# EAGLE design TransistorsArduino (EAGLE 6.1)
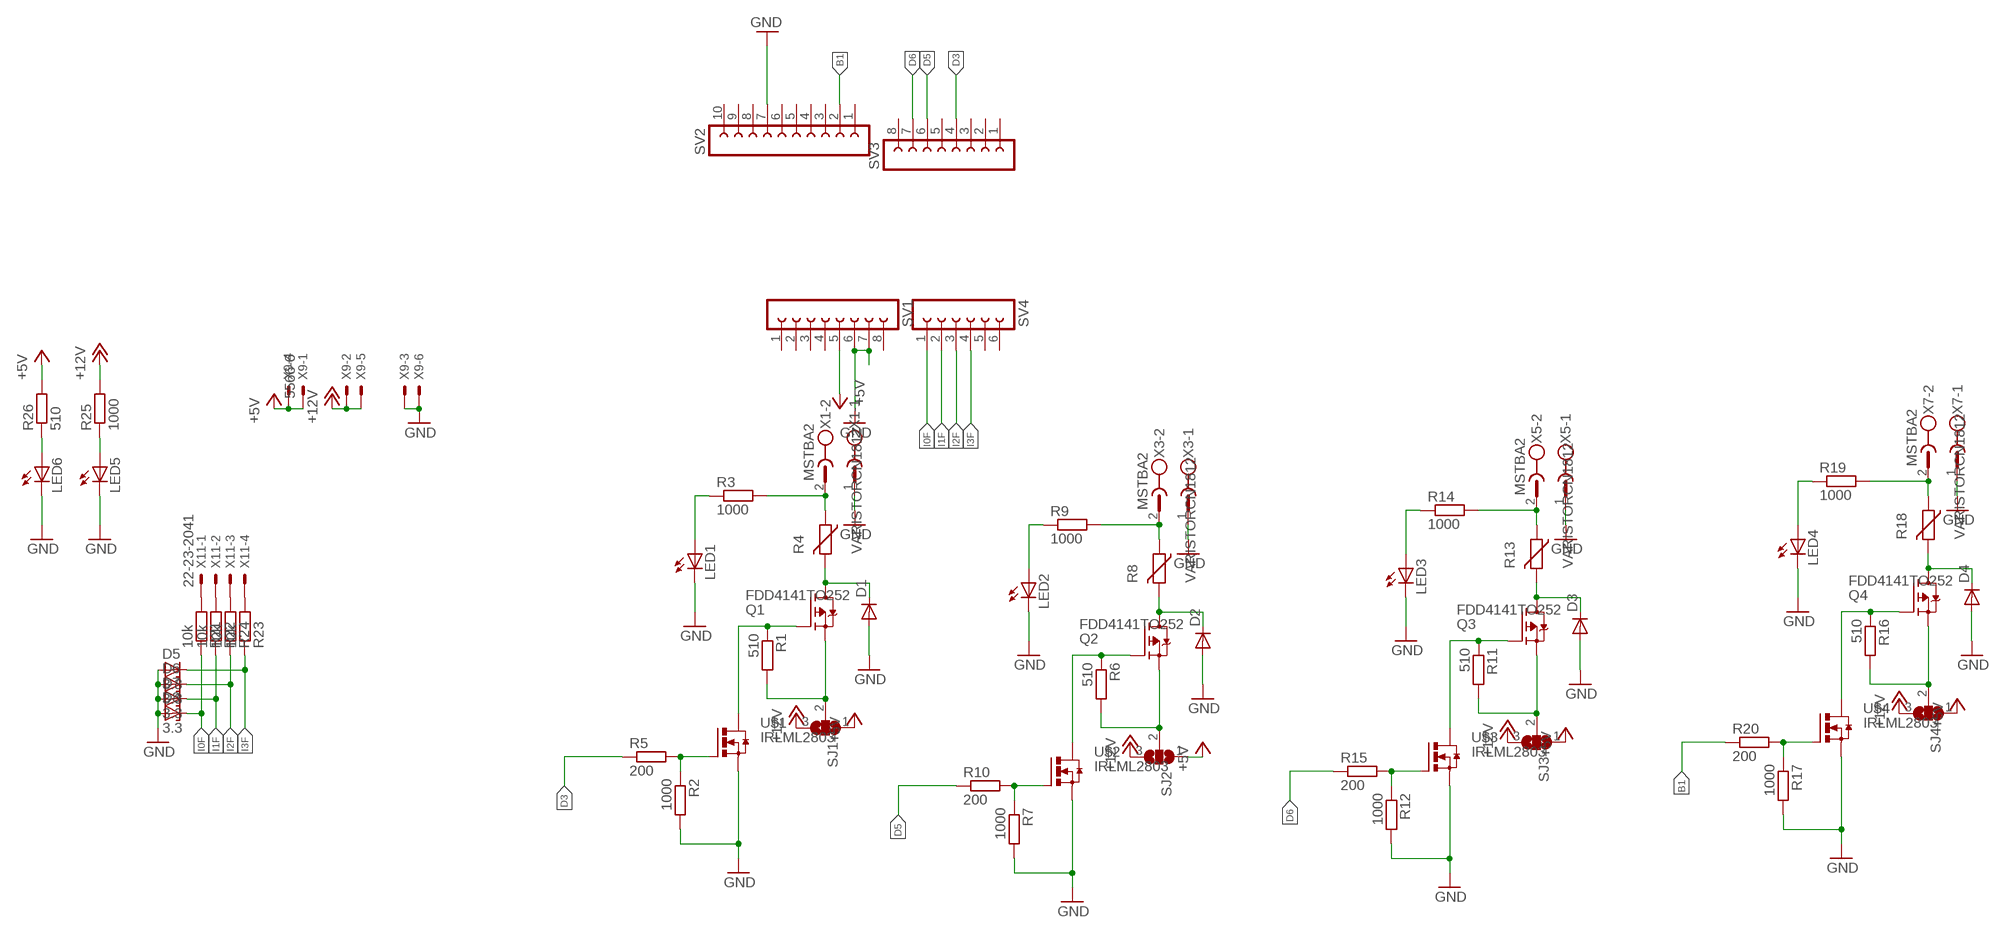
[diagram p0: schematic, sheet 1]

## Parts
D1  DIODE-SMB  [SMB]
D2  DIODE-SMB  [SMB]
D3  DIODE-SMB  [SMB]
D4  DIODE-SMB  [SMB]
D5  3.3  ZENER-DIODESOD80C  [SOD80C]
D6  3.3  ZENER-DIODESOD80C  [SOD80C]
D7  3.3  ZENER-DIODESOD80C  [SOD80C]
D8  3.3  ZENER-DIODESOD80C  [SOD80C]
LED1  LEDCHIPLED_1206  [CHIPLED_1206]
LED2  LEDCHIPLED_1206  [CHIPLED_1206]
LED3  LEDCHIPLED_1206  [CHIPLED_1206]
LED4  LEDCHIPLED_1206  [CHIPLED_1206]
LED5  LEDCHIPLED_1206  [CHIPLED_1206]
LED6  LEDCHIPLED_1206  [CHIPLED_1206]
Q1  FDD4141TO252  [TO252]
Q2  FDD4141TO252  [TO252]
Q3  FDD4141TO252  [TO252]
Q4  FDD4141TO252  [TO252]
R1  510  R-EU_M0805  [M0805]
R2  1000  R-EU_M0805  [M0805]
R3  1000  R-EU_M0805  [M0805]
R4  VARISTORCN1812  [CT/CN1812]
R5  200  R-EU_M0805  [M0805]
R6  510  R-EU_M0805  [M0805]
R7  1000  R-EU_M0805  [M0805]
R8  VARISTORCN1812  [CT/CN1812]
R9  1000  R-EU_M0805  [M0805]
R10  200  R-EU_M0805  [M0805]
R11  510  R-EU_M0805  [M0805]
R12  1000  R-EU_M0805  [M0805]
R13  VARISTORCN1812  [CT/CN1812]
R14  1000  R-EU_M0805  [M0805]
R15  200  R-EU_M0805  [M0805]
R16  510  R-EU_M0805  [M0805]
R17  1000  R-EU_M0805  [M0805]
R18  VARISTORCN1812  [CT/CN1812]
R19  1000  R-EU_M0805  [M0805]
R20  200  R-EU_M0805  [M0805]
R21  10k  R-EU_M0805  [M0805]
R22  10k  R-EU_M0805  [M0805]
R23  10k  R-EU_M0805  [M0805]
R24  10k  R-EU_M0805  [M0805]
R25  1000  R-EU_M0805  [M0805]
R26  510  R-EU_M0805  [M0805]
SJ1  SJ2W  [SJ_2]
SJ2  SJ2W  [SJ_2]
SJ3  SJ2W  [SJ_2]
SJ4  SJ2W  [SJ_2]
SV1  FE08-1  [FE08]
SV2  FE10-1  [FE10]
SV3  FE08-1  [FE08]
SV4  FE06-1  [FE06]
U$1  IRLML2803  [SUPER-SOT3]
U$2  IRLML2803  [SUPER-SOT3]
U$3  IRLML2803  [SUPER-SOT3]
U$4  IRLML2803  [SUPER-SOT3]
X1  MSTBA2  [MSTBA2]
X3  MSTBA2  [MSTBA2]
X5  MSTBA2  [MSTBA2]
X7  MSTBA2  [MSTBA2]
X9  5566-6  [5566-6]
X11  22-23-2041  [22-23-2041]

## Nets
+5V: R26.2 SJ1.1 SJ2.1 SJ3.1 SJ4.1 SV1.5 X9.1 X9.4
+12V: R25.2 SJ1.3 SJ2.3 SJ3.3 SJ4.3 X9.2 X9.5
B1: R20.1 SV2.2
D3: R5.1 SV3.4
D5: R10.1 SV3.6
D6: R15.1 SV3.7
GND: D1.A D2.A D3.A D4.A D5.A D6.A D7.A D8.A LED1.C LED2.C LED3.C LED4.C LED5.C LED6.C R2.2 R7.2 R12.2 R17.2 SV1.6 SV1.7 SV2.7 U$1.2(S) U$2.2(S) U$3.2(S) U$4.2(S) X1.1 X3.1 X5.1 X7.1 X9.3 X9.6
I0F: D8.C R21.1 SV4.1
I1F: D7.C R22.1 SV4.2
I2F: D6.C R24.1 SV4.3
I3F: D5.C R23.1 SV4.4
N$1: Q1.2(S) R1.2 SJ1.2
N$2: Q1.1(G) R1.1 U$1.3(D)
N$3: R2.1 R5.2 U$1.1(G)
N$5: LED1.A R3.1
N$7: Q2.2(S) R6.2 SJ2.2
N$8: Q2.1(G) R6.1 U$2.3(D)
N$9: R7.1 R10.2 U$2.1(G)
N$12: LED2.A R9.1
N$13: Q3.2(S) R11.2 SJ3.2
N$14: Q3.1(G) R11.1 U$3.3(D)
N$15: R12.1 R15.2 U$3.1(G)
N$16: R21.2 X11.1
N$17: R22.2 X11.2
N$18: LED3.A R14.1
N$19: Q4.2(S) R16.2 SJ4.2
N$20: Q4.1(G) R16.1 U$4.3(D)
N$21: R17.1 R20.2 U$4.1(G)
N$22: R23.2 X11.4
N$23: R24.2 X11.3
N$24: LED4.A R19.1
N$26: LED6.A R26.1
N$27: LED5.A R25.1
OUT1: R3.2 R4.1 X1.2
OUT2: R8.1 R9.2 X3.2
OUT3: R13.1 R14.2 X5.2
OUT4: R18.1 R19.2 X7.2
TH1: D1.C Q1.3(D) R4.2
TH2: D2.C Q2.3(D) R8.2
TH3: D3.C Q3.3(D) R13.2
TH4: D4.C Q4.3(D) R18.2
Unconnected: SV1.1 SV1.2 SV1.3 SV1.4 SV1.8 SV2.1 SV2.3 SV2.4 SV2.5 SV2.6 SV2.8 SV2.9 SV2.10 SV3.1 SV3.2 SV3.3 SV3.5 SV3.8 SV4.5 SV4.6

## Library data of the parts
D1-D4 = diode:DIODE-: DIODE
D5-D8 = diode:ZENER-DIODE: Z-Diode
LED1-LED6 = led:LED: LED OSRAM: - CHIPLED LG R971, LG N971, LY N971, LG Q971, LY Q971, LO R971, LY R971 LH N974, LH R974 LS Q976, LO Q976, LY Q976 LO Q996 - Hyper CHIPLED LW Q18S LB Q993, LB Q99A, LB R99A - SideLED LS A670, LO A670, LY A670, LG A670, LP A670 LB A673, LV A673, LT A673, LW A673 LH A674 LY A675 LS A676, LA A676, LO A676, LY A676, LW A676 LS A679, LY A679, LG A679 - Hyper Micro SIDELED® LS Y876, LA Y876, LO Y876, LY Y876 LT Y87S - SmartLED LW L88C, LW L88S LB L89C, LB L89S, LG L890 LS L89K, LO L89K, LY L89K LS L896, LA L896, LO L896, LY L896 - TOPLED LS T670, LO T670, LY T670, LG T670, LP T670 LSG T670, LSP T670, LSY T670, LOP T670, LYG T670 LG T671, LOG T671, LSG T671 LB T673, LV T673, LT T673, LW T673 LH T674 LS T676, LA T676, LO T676, LY T676, LB T676, LH T676, LSB T676, LW T676 LB T67C, LV T67C, LT T67C, LS T67K, LO T67K, LY T67K, LW E67C LS E67B, LA E67B, LO E67B, LY E67B, LB E67C, LV E67C, LT E67C LW T67C LS T679, LY T679, LG T679 LS T770, LO T770, LY T770, LG T770, LP T770 LB T773, LV T773, LT T773, LW T773 LH T774 LS E675, LA E675, LY E675, LS T675 LS T776, LA T776, LO T776, LY T776, LB T776 LHGB T686 LT T68C, LB T68C - Hyper Mini TOPLED® LB M676 - Mini TOPLED Santana® LG M470 LS M47K, LO M47K, LY M47K Source: http://www.osram.convergy.de LUXEON: - LUMILED® LXK2-PW12-R00, LXK2-PW12-S00, LXK2-PW14-U00, LXK2-PW14-V00 LXK2-PM12-R00, LXK2-PM12-S00, LXK2-PM14-U00 LXK2-PE12-Q00, LXK2-PE12-R00, LXK2-PE12-S00, LXK2-PE14-T00, LXK2-PE14-U00 LXK2-PB12-K00, LXK2-PB12-L00, LXK2-PB12-M00, LXK2-PB14-N00, LXK2-PB14-P00, LXK2-PB14-Q00 LXK2-PR12-L00, LXK2-PR12-M00, LXK2-PR14-Q00, LXK2-PR14-R00 LXK2-PD12-Q00, LXK2-PD12-R00, LXK2-PD12-S00 LXK2-PH12-R00, LXK2-PH12-S00 LXK2-PL12-P00, LXK2-PL12-Q00, LXK2-PL12-R00 Source: www.luxeon.com KINGBRIGHT: KA-3528ASYC Source: www.kingbright.com
Q1-Q4 = transistor-fet:FDD4141: P-Channel PowerTrench® MOSFET Source: FDD4141.pdf
R1-R3 R5-R7 R9-R12 R14-R17 R19-R26 = rcl:R-EU_: RESISTOR, European symbol
R4 R8 R13 R18 = varistor:VARISTOR: VARISTOR
SJ1-SJ4 = jumper:SJ2W: SMD solder JUMPER
SV1 SV3 = con-lsta:FE08-1: FEMALE HEADER; OC_FARNELL: unknown; OC_NEWARK: unknown
SV2 = con-lsta:FE10-1: FEMALE HEADER; OC_FARNELL: unknown; OC_NEWARK: unknown
SV4 = con-lsta:FE06-1: FEMALE HEADER; OC_FARNELL: unknown; OC_NEWARK: unknown
U$1-U$4 = transistor-power:IRLML2803
X1 X3 X5 X7 = con-phoenix-508:MSTBA2: PHOENIX; MF: FARNELL; MPN: 1757242; OC_FARNELL: 3705171; OC_NEWARK: 71C4161
X9 = con-molex:5566-6: Mini FIT connector 6 pol Source: http://www.molex.com; MPN: 95566-61002; OC_FARNELL: unknown; OC_NEWARK: 22K8620
X11 = con-molex:22-23-2041: .100" (2.54mm) Center Header - 4 Pin; MF: MOLEX; MPN: 22-23-2041; OC_FARNELL: 1462920; OC_NEWARK: 38C0355

## Board
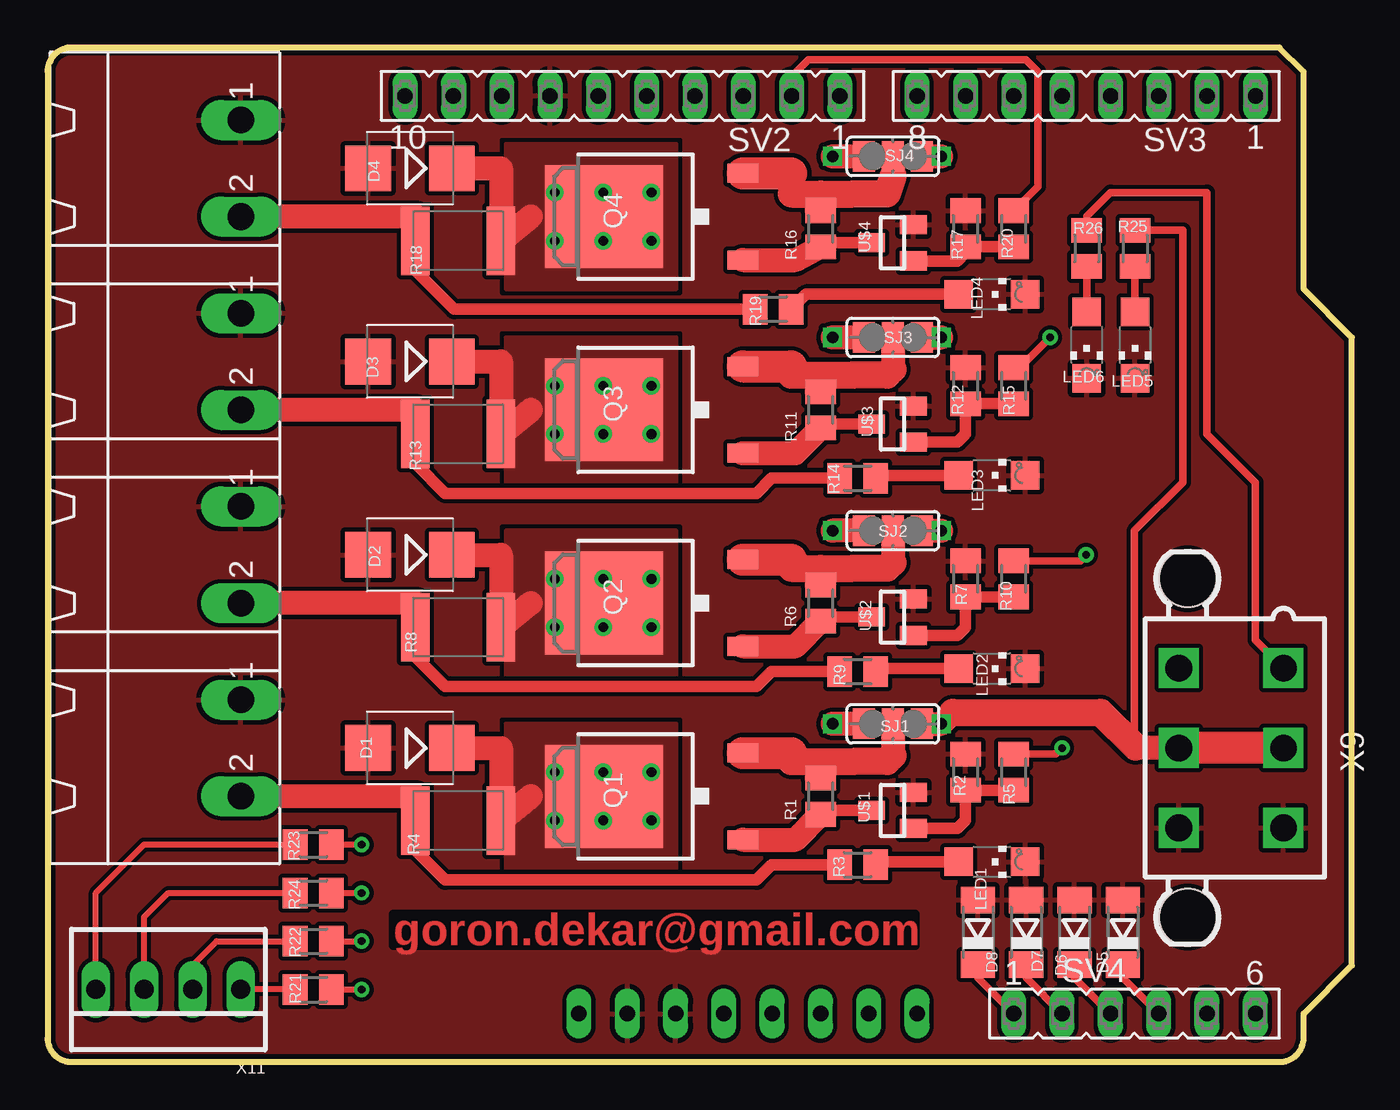
[diagram p1: board, top side]
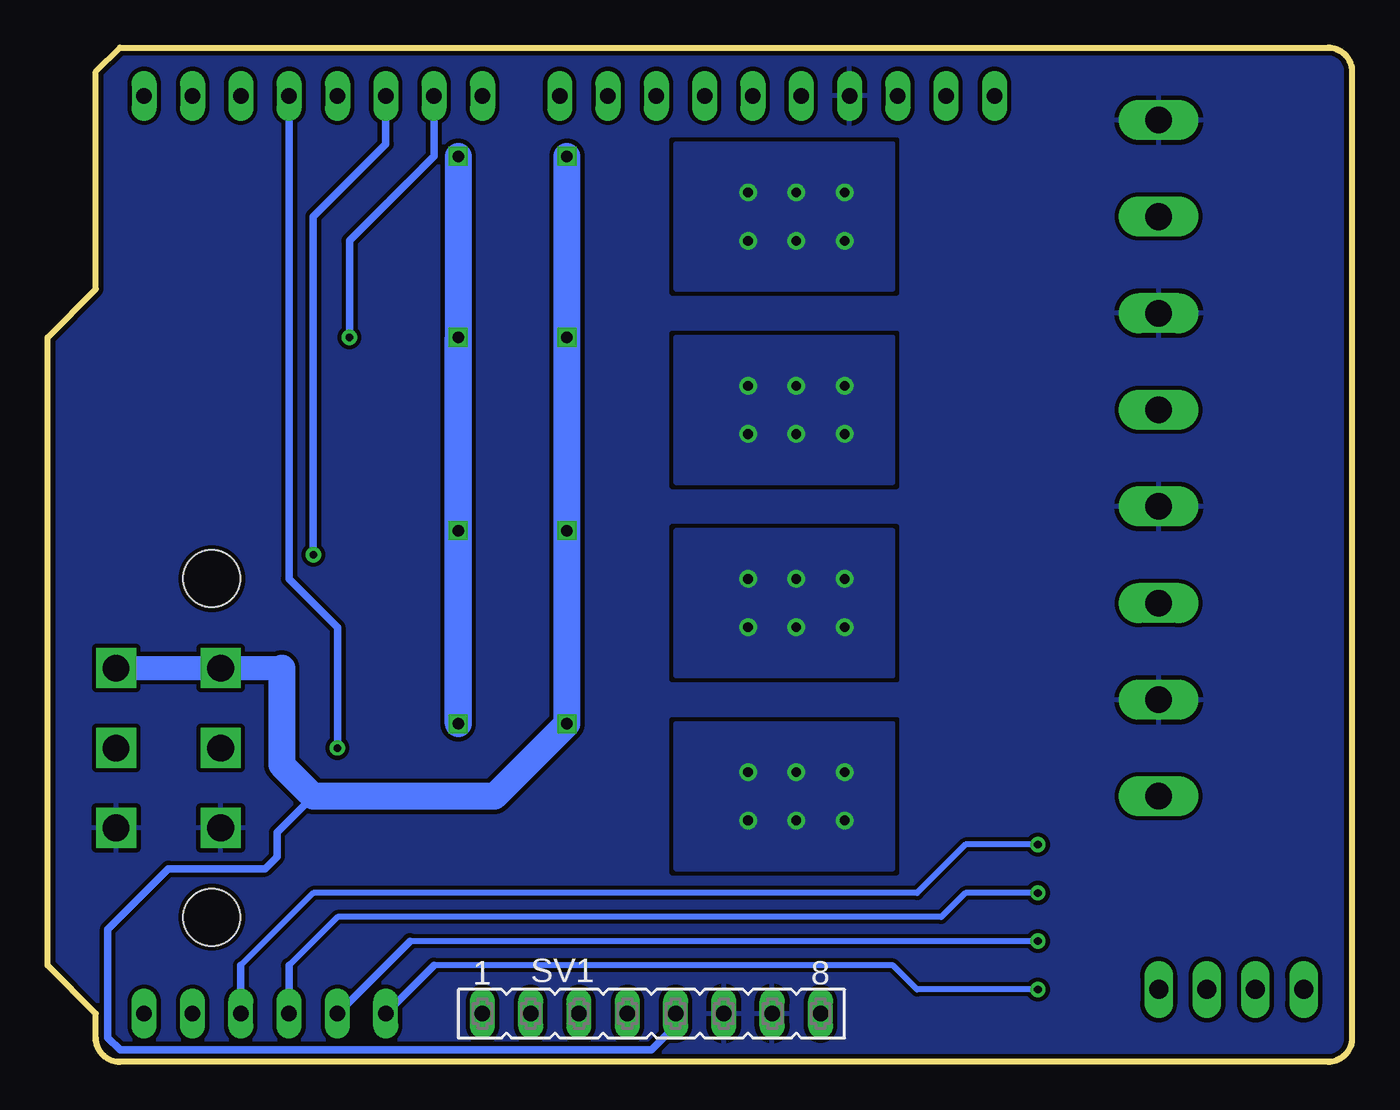
[diagram p2: board, bottom side, seen from below]

Size 68.58 x 53.34 mm. Coordinates in mm from the lower left corner, seen from the top.
Outline: 1.27,0 64.77,0 arc90 66.04,1.27 66.04,2.54 68.58,5.08 68.58,38.1 66.04,40.64 66.04,52.07 64.77,53.34 1.27,53.34 arc90 0,52.07 0,1.27 arc90 1.27,0
Copper layers (1+16): Top 0.0178mm / dielectric 1.5011mm / Bottom 0.0178mm
Design rules: minimum track width 0.2mm, minimum drill 0.3mm, track to track 0.22mm, track to pad 0.22mm, pad to pad 0.22mm, via to via 0.22mm, smd to smd 0mil, copper to edge 0.25mm, drill to drill 0.2mm, minimum pad ring 10mil, minimum via ring 8mil, stop-mask expansion 4mil, vias tented up to drill 0.5mm, thermal gap 10mil

### Footprints (pad centres in the part's own frame; a part is rotated, then mirrored left to right if it is on the bottom)
SMB = smd 2.4 x 2.4: A 2.2,0; C -2.2,0
SOD80C = smd 1.4 x 1.8: A 1.7,0; C -1.7,0
CHIPLED_1206 = smd 1.5 x 1.5: A 0,-1.75; C 0,1.75
TO252 = smd 1 x 1.6: 1 -2.28,-4.8; 2 2.28,-4.8 | smd 5.4 x 6.2: 3 0,2.5
M0805 = smd 1.3 x 1.6: 1 -0.95,0; 2 0.95,0
CT/CN1812 = smd 1.5 x 3.6: 1 -2.25,0; 2 2.25,0
SJ_2 = smd 1.168 x 1.6: 1 -1.524,0; 2 0,0; 3 1.524,0
FE08 = drill 0.813 long: 1 -8.89,0; 2 -6.35,0; 3 -3.81,0; 4 -1.27,0; 5 1.27,0; 6 3.81,0; 7 6.35,0; 8 8.89,0
FE10 = drill 0.813 long: 1 -11.43,0; 2 -8.89,0; 3 -6.35,0; 4 -3.81,0; 5 -1.27,0; 6 1.27,0; 7 3.81,0; 8 6.35,0; 9 8.89,0; 10 11.43,0
FE06 = drill 0.813 long: 1 -6.35,0; 2 -3.81,0; 3 -1.27,0; 4 1.27,0; 5 3.81,0; 6 6.35,0
SUPER-SOT3 = smd 1 x 1.4: 1 -0.95,-1.1; 2 0.95,-1.1; 3 0,1.1
MSTBA2 = drill 1.397 long: 1 -2.54,5.08; 2 2.54,5.08
5566-6 = drill 1.4 square: 1 4.2,-2.75; 2 0,-2.75; 3 -4.2,-2.75; 4 4.2,2.75; 5 0,2.75; 6 -4.2,2.75 | hole 3: 8.9,2.29; -8.9,2.29
22-23-2041 = drill 1 long: 1 -3.81,0; 2 -1.27,0; 3 1.27,0; 4 3.81,0

### Placement (x,y rotation side)
D1  19.05,16.51 180 top
D2  19.05,26.67 180 top
D3  19.05,36.83 180 top
D4  19.05,46.99 180 top
D5  56.54,6.82 90 top
D6  54,6.82 90 top
D7  51.46,6.82 90 top
D8  48.92,6.82 90 top
LED1  49.65,10.52 270 top
LED2  49.65,20.68 270 top
LED3  49.65,30.84 270 top
LED4  49.65,40.37 270 top
LED5  57.18,37.7 180 top
LED6  54.64,37.7 180 top
Q1  31.75,13.97 90 top
Q2  31.75,24.13 90 top
Q3  31.75,34.29 90 top
Q4  31.75,44.45 90 top
R1  40.64,13.97 90 top
R2  48.26,15.24 90 top
R3  42.6,10.37 180 top
R4  21.59,12.7 0 top
R5  50.8,15.24 270 top
R6  40.64,24.13 90 top
R7  48.26,25.4 90 top
R8  21.59,22.86 0 top
R9  42.6,20.53 180 top
R10  50.8,25.4 270 top
R11  40.64,34.29 90 top
R12  48.26,35.56 90 top
R13  21.59,33.02 0 top
R14  42.6,30.69 180 top
R15  50.8,35.56 270 top
R16  40.64,43.81 90 top
R17  48.26,43.81 90 top
R18  21.59,43.18 0 top
R19  38.15,39.58 180 top
R20  50.8,43.81 270 top
R21  13.97,3.81 180 top
R22  13.97,6.35 180 top
R23  13.97,11.43 180 top
R24  13.97,8.89 180 top
R25  57.18,42.78 90 top
R26  54.64,42.78 90 top
SJ1  44.45,17.78 0 top
SJ2  44.45,27.94 0 top
SJ3  44.45,38.1 0 top
SJ4  44.45,47.62 0 top
SV1  36.83,2.54 0 bottom
SV2  30.23,50.8 180 top
SV3  54.61,50.8 180 top
SV4  57.15,2.54 0 top
U$1  44.42,13.23 90 top
U$2  44.42,23.39 90 top
U$3  44.42,33.55 90 top
U$4  44.42,43.07 90 top
X1  5.08,16.51 270 top
X3  5.08,26.67 270 top
X5  5.08,36.83 270 top
X7  5.08,46.99 270 top
X9  62.23,16.51 90 top
X11  6.35,3.81 180 top

### Tracks (layer width: path | path; a pad name or v marks a point on that pad's centre or on a via)
+5V  (via drill 0.6)
  Top 0.406: R26.2 54.64,44.48 55.88,45.72 60.96,45.72 60.96,33.02 63.5,30.48 63.5,22.19 X9.1
  Top 1.27: SJ1.1 v41.28,17.78 | v41.28,47.62 SJ4.1 | SJ3.1 v41.28,38.1 | SJ2.1 v41.28,27.94
  Bottom 0.406: 54.61,13.97 56.52,12.06 56.52,10.79 57.15,10.16 62.23,10.16 65.41,6.99 65.41,1.27 64.77,0.64 36.83,0.64 35.56,1.91 SV1.5
  Bottom 1.27: X9.1 X9.4 56.27,20.71
  Bottom 1.422: v41.28,47.62 v41.28,38.1 v41.28,27.94 v41.28,17.78 45.09,13.97 54.61,13.97 56.27,15.63 56.27,20.71
+12V  (via drill 0.6)
  Top 0.406: R25.2 59.69,43.73 59.69,30.48 57.15,27.94 57.15,16.6 57.19,16.55
  Top 1.27: SJ1.3 v46.99,17.78 47.6,18.39 | SJ2.3 v46.99,27.94 | SJ3.3 v46.99,38.1 | SJ4.3 v46.99,47.62 | 56.63,17.12 57.19,16.55 57.24,16.51 X9.5 59.69,16.51 | 64.77,16.51 X9.2
  Top 1.422: 47.6,18.39 55.36,18.39 57.19,16.55
  Top 1.676: 64.77,16.51 59.69,16.51
  Bottom 1.422: v46.99,38.1 v46.99,27.94 v46.99,17.78 v46.99,38.1 | v46.99,47.62 v46.99,38.1
B1
  Top 0.406: R20.1 52.07,46.03 52.07,52.07 51.44,52.7 40.01,52.7 39.1,51.8 39.1,50.82 SV2.2
D3  (via drill 0.4)
  Top 0.406: v53.34,16.51 53.02,16.19 R5.1
  Bottom 0.406: v53.34,16.51 53.34,22.86 55.88,25.4 SV3.4
D5  (via drill 0.4)
  Top 0.406: v54.61,26.67 54.29,26.35 R10.1
  Bottom 0.406: v54.61,26.67 54.61,44.45 50.8,48.26 SV3.6
D6  (via drill 0.4)
  Top 0.406: v52.71,38.1 51.12,36.51 R15.1
  Bottom 0.406: v52.71,38.1 52.71,43.18 48.26,47.62 SV3.7
GND
  pour Top (rank 4): 0,53.34 68.58,53.34 68.58,0 0,0
  pour Bottom (rank 6): 0.03,53.37 68.58,53.37 68.58,0 0,0 0,53.34
I0F  (via drill 0.4)
  Top 0.305: R21.1 v16.51,3.81
  Top 0.406: D8.C 48.92,4.42 SV4.1
  Bottom 0.305: v16.51,3.81 22.86,3.81 24.13,5.08 48.26,5.08
  Bottom 0.406: 48.26,5.08 SV4.1
I1F  (via drill 0.4)
  Top 0.305: R22.1 v16.51,6.35
  Top 0.406: D7.C 51.46,4.42 SV4.2
  Bottom 0.305: v16.51,6.35 49.53,6.35
  Bottom 0.406: 49.53,6.35 SV4.2
I2F  (via drill 0.4)
  Top 0.305: R24.1 v16.51,8.89
  Top 0.406: D6.C 54,4.42 SV4.3
  Bottom 0.305: v16.51,8.89 20.32,8.89 21.59,7.62 53.34,7.62 55.88,5.08
  Bottom 0.406: 55.88,5.08 SV4.3
I3F  (via drill 0.4)
  Top 0.305: R23.1 v16.51,11.43
  Top 0.406: D5.C 56.54,4.42 SV4.4
  Bottom 0.305: v16.51,11.43 20.32,11.43 22.86,8.89 54.61,8.89 58.42,5.08
  Bottom 0.406: 58.42,5.08 SV4.4
N$1
  Top 0.406: R1.2 40.64,15.79
  Top 1.27: R1.2 40.44,14.92 | SJ1.2 44.45,16.1
  Top 1.422: 44.45,16.1 44.14,15.79 42.35,15.79 | 42.35,15.79 42.34,15.8 | 42.35,15.79 40.64,15.79 39.11,15.79 39.11,16.25
  Top 1.676: Q1.2 39.11,16.25
N$2
  Top 0.61: U$1.3 40.85,13.23 R1.1
  Top 1.27: Q1.1 39.31,11.69 R1.1
N$3
  Top 0.61: U$1.1 47.84,12.28 48.26,12.7 R2.1 R5.2
N$5
  Top 0.61: LED1.A 43.7,10.52 R3.1
N$7
  Top 0.406: R6.2 40.64,25.95
  Top 1.27: R6.2 40.44,25.08 | SJ2.2 44.45,26.26
  Top 1.422: 44.45,26.26 44.14,25.95 42.35,25.95 | 42.35,25.95 42.34,25.96 | 42.35,25.95 40.64,25.95 39.11,25.95 39.11,26.41
  Top 1.676: Q2.2 39.11,26.41
N$8
  Top 0.61: U$2.3 40.85,23.39 R6.1
  Top 1.27: Q2.1 39.31,21.85 R6.1
N$9
  Top 0.61: U$2.1 47.84,22.44 48.26,22.86 R7.1 R10.2
N$12
  Top 0.61: LED2.A 43.7,20.68 R9.1
N$13
  Top 0.406: R11.2 40.64,36.11
  Top 1.27: R11.2 40.44,35.24 | SJ3.2 44.45,36.42
  Top 1.422: 44.45,36.42 44.14,36.11 42.35,36.11 | 42.35,36.11 42.34,36.12 | 42.35,36.11 40.64,36.11 39.11,36.11 39.11,36.57
  Top 1.676: Q3.2 39.11,36.57
N$14
  Top 0.61: U$3.3 40.85,33.55 R11.1
  Top 1.27: Q3.1 39.31,32.01 R11.1
N$15
  Top 0.61: U$3.1 47.84,32.6 48.26,33.02 R12.1 R15.2
N$16
  Top 0.305: R21.2 X11.1
N$17
  Top 0.305: X11.2 7.62,5.08 8.89,6.35 R22.2
N$18
  Top 0.61: LED3.A 43.7,30.84 R14.1
N$19
  Top 0.406: R16.2 40.64,45.64
  Top 1.27: R16.2 40.44,44.77 | SJ4.2 44.45,46.58
  Top 1.422: 44.45,46.58 44.14,45.64 42.35,45.64 | 42.35,45.64 42.34,45.65 | 42.35,45.64 40.64,45.64 39.11,45.64 39.11,46.73
  Top 1.676: Q4.2 39.11,46.73
N$20
  Top 0.61: U$4.3 40.85,43.07 R16.1
  Top 1.27: Q4.1 39.31,42.17 R16.1
N$21
  Top 0.61: U$4.1 47.84,42.12 48.26,42.55 R17.1 R20.2
N$22
  Top 0.305: X11.4 2.54,8.89 5.08,11.43 R23.2
N$23
  Top 0.305: X11.3 5.08,7.62 6.35,8.89 R24.2
N$24
  Top 0.61: LED4.A 39.89,40.37 R19.1
N$26
  Top 0.406: R26.1 LED6.A
N$27
  Top 0.406: R25.1 LED5.A
OUT1
  Top 0.61: R3.2 38.07,10.37 37.28,9.57 20.91,9.57 19.34,11.14 R4.1
  Top 1.27: R4.1 19.37,13.97 X1.2
OUT2
  Top 0.61: R9.2 38.07,20.53 37.28,19.73 20.91,19.73 19.34,21.3 R8.1
  Top 1.27: R8.1 19.37,24.13 X3.2
OUT3
  Top 0.61: R14.2 38.07,30.69 37.28,29.89 20.91,29.89 19.34,31.46 R13.1
  Top 1.27: R13.1 19.37,34.29 X5.2
OUT4
  Top 0.61: R18.1 19.34,41.62 21.38,39.58 R19.2
  Top 1.27: R18.1 19.37,44.45 X7.2
TH1  (via drill 0.51)
  Top 1.27: 25.4,13.97 R4.2 23.84,16.51 D1.C
  other vias: 29.21,12.7 29.21,15.24 26.67,15.24 26.67,12.7 31.75,12.7 31.75,15.24
  pour Bottom: 24.13,10.16 24.13,17.78 35.56,17.78 35.56,10.16
  pour Top (no thermals): 24.13,10.16 24.13,17.78 33.02,17.78 33.02,10.16
TH2  (via drill 0.51)
  Top 1.27: 25.4,24.13 R8.2 23.84,26.67 D2.C
  other vias: 29.21,22.86 29.21,25.4 26.67,25.4 26.67,22.86 31.75,22.86 31.75,25.4
  pour Top (no thermals): 24.13,20.32 24.13,27.94 33.02,27.94 33.02,20.32
  pour Bottom: 24.13,20.32 24.13,27.94 35.56,27.94 35.56,20.32
TH3  (via drill 0.51)
  Top 1.27: 25.4,34.29 R13.2 23.84,36.83 D3.C
  other vias: 29.21,33.02 29.21,35.56 26.67,35.56 26.67,33.02 31.75,33.02 31.75,35.56
  pour Top (no thermals): 24.13,30.48 24.13,38.1 33.02,38.1 33.02,30.48
  pour Bottom: 24.13,30.48 24.13,38.1 35.56,38.1 35.56,30.48
TH4  (via drill 0.51)
  Top 1.27: 25.4,44.45 R18.2 23.84,46.99 D4.C
  other vias: 29.21,43.18 29.21,45.72 26.67,45.72 26.67,43.18 31.75,43.18 31.75,45.72
  pour Top (no thermals): 24.13,40.64 24.13,48.26 33.02,48.26 33.02,40.64
  pour Bottom: 24.13,40.64 24.13,48.26 35.56,48.26 35.56,40.64

### Text on the board
Top: goron.dekar@gmail.com